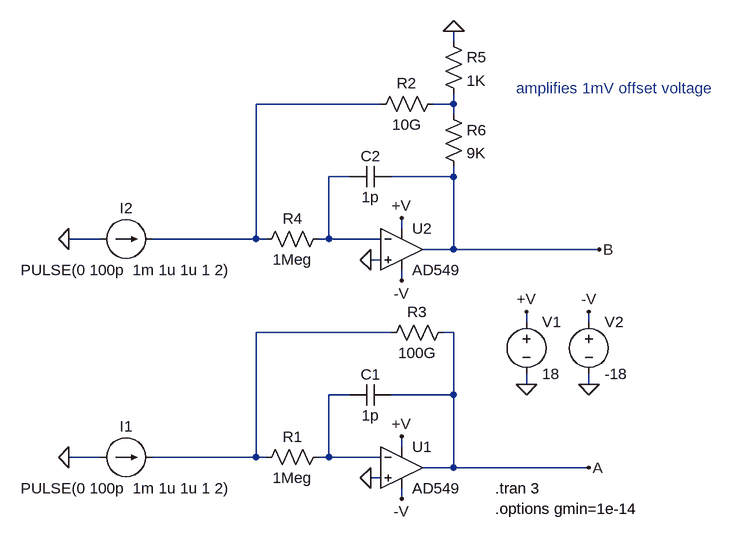
[diagram p0: schematic ElectrometerFeedback.asc]
ElectrometerFeedback.asc, the LTspice schematic file:
Version 4
SHEET 1 2884 3000
WIRE 288 -608 288 -624
WIRE 176 -512 -16 -512
WIRE 288 -512 288 -528
WIRE 288 -512 256 -512
WIRE 288 -496 288 -512
WIRE 128 -400 96 -400
WIRE 288 -400 288 -416
WIRE 288 -400 192 -400
WIRE 208 -320 208 -336
WIRE -256 -304 -304 -304
WIRE -16 -304 -16 -512
WIRE -16 -304 -176 -304
WIRE 0 -304 -16 -304
WIRE 96 -304 96 -400
WIRE 96 -304 80 -304
WIRE 176 -304 96 -304
WIRE 288 -288 288 -400
WIRE 288 -288 240 -288
WIRE 512 -288 288 -288
WIRE 176 -272 160 -272
WIRE 208 -240 208 -256
WIRE 400 -176 400 -192
WIRE 496 -176 496 -192
WIRE 192 -160 -16 -160
WIRE 288 -160 272 -160
WIRE 400 -80 400 -96
WIRE 496 -80 496 -96
WIRE 128 -64 96 -64
WIRE 288 -64 288 -160
WIRE 288 -64 192 -64
WIRE 208 16 208 0
WIRE -256 32 -304 32
WIRE -16 32 -16 -160
WIRE -16 32 -176 32
WIRE 0 32 -16 32
WIRE 96 32 96 -64
WIRE 96 32 80 32
WIRE 176 32 96 32
WIRE 288 48 288 -64
WIRE 288 48 240 48
WIRE 496 48 288 48
WIRE 176 64 160 64
WIRE 208 96 208 80
FLAG 400 -80 0
FLAG 496 -80 0
FLAG 400 -192 +V
FLAG 496 -192 -V
FLAG 208 0 +V
FLAG 208 96 -V
FLAG 160 64 0
FLAG -304 32 0
FLAG 208 -336 +V
FLAG 208 -240 -V
FLAG 160 -272 0
FLAG -304 -304 0
FLAG 288 -624 0
FLAG 496 48 A
FLAG 512 -288 B
SYMBOL voltage 400 -192 R0
SYMATTR InstName V1
SYMATTR Value 18
SYMBOL voltage 496 -192 R0
SYMATTR InstName V2
SYMATTR Value -18
SYMBOL current -256 32 M90
WINDOW 0 -32 40 VBottom 2
WINDOW 3 32 40 VTop 2
WINDOW 123 74 40 VTop 2
WINDOW 39 53 40 VTop 2
SYMATTR InstName I1
SYMATTR Value PULSE(0 100p  1m 1u 1u 1 2)
SYMBOL res 288 -176 R90
WINDOW 0 0 56 VBottom 2
WINDOW 3 32 56 VTop 2
SYMATTR InstName R3
SYMATTR Value 100G
SYMBOL cap 192 -48 M270
WINDOW 0 32 32 VTop 2
WINDOW 3 0 32 VBottom 2
SYMATTR InstName C1
SYMATTR Value 1p
SYMBOL Opamps\\AD549 208 -16 R0
SYMATTR InstName U1
SYMBOL res 96 16 R90
WINDOW 0 0 56 VBottom 2
WINDOW 3 32 56 VTop 2
SYMATTR InstName R1
SYMATTR Value 1Meg
SYMBOL current -256 -304 M90
WINDOW 0 -32 40 VBottom 2
WINDOW 3 32 40 VTop 2
WINDOW 123 74 40 VTop 2
WINDOW 39 53 40 VTop 2
SYMATTR InstName I2
SYMATTR Value PULSE(0 100p  1m 1u 1u 1 2)
SYMBOL res 272 -528 R90
WINDOW 0 0 56 VBottom 2
WINDOW 3 32 56 VTop 2
SYMATTR InstName R2
SYMATTR Value 10G
SYMBOL cap 192 -384 M270
WINDOW 0 32 32 VTop 2
WINDOW 3 0 32 VBottom 2
SYMATTR InstName C2
SYMATTR Value 1p
SYMBOL Opamps\\AD549 208 -352 R0
SYMATTR InstName U2
SYMBOL res 96 -320 R90
WINDOW 0 0 56 VBottom 2
WINDOW 3 32 56 VTop 2
SYMATTR InstName R4
SYMATTR Value 1Meg
SYMBOL res 272 -624 R0
SYMATTR InstName R5
SYMATTR Value 1K
SYMBOL res 272 -512 R0
SYMATTR InstName R6
SYMATTR Value 9K
TEXT 352 80 Left 2 !.tran 3\n.options gmin=1e-14
TEXT 384 -536 Left 2 ;amplifies 1mV offset voltage

The netlist it stands for:
* ElectrometerFeedback.asc
V1 +V 0 18
V2 -V 0 -18
I1 0 N004 PULSE(0 100p  1m 1u 1u 1 2)
R3 A N004 100G
C1 A N005 1p
XU1 0 N005 +V -V A AD549  ; pins In+ In- V+ V- OUT
R1 N005 N004 1Meg
I2 0 N001 PULSE(0 100p  1m 1u 1u 1 2)
R2 N002 N001 10G
C2 B N003 1p
XU2 0 N003 +V -V B AD549  ; pins In+ In- V+ V- OUT
R4 N003 N001 1Meg
R5 0 N002 1K
R6 N002 B 9K
.tran 3
.options gmin=1e-14
* amplifies 1mV offset voltage
.backanno
.end